# EAGLE schematic rgb_circuit_diagram_1R (EAGLE 7.5.0)
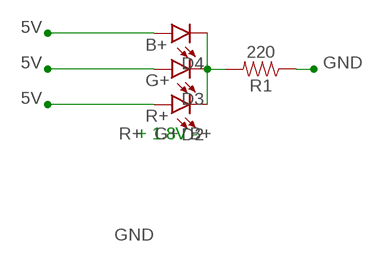
[diagram p0: schematic, sheet 1]

## Parts
D2  LED-3MM-NO_SILK  [LED_3MM-NS]
D3  LED-3MM-NO_SILK  [LED_3MM-NS]
D4  LED-3MM-NO_SILK  [LED_3MM-NS]
R1  220  220OHM-0603-1/10W-1%  [0603]

## Nets
B+: D4.A
G+: D3.A
GND: D2.K(C) D3.K(C) D4.K(C) R1.2
N$1: R1.1
R+: D2.A

## Notes on the sheet
- + 1.8V -

## Library data of the parts
D2-D4 = SparkFun-LED:LED: LED (Generic) Standard schematic elements and footprints for 5mm, 3mm, 1206, and 0603 sized LEDs. Generic LEDs with no color specified.
R1 = SparkFun-Resistors:220OHM: 220Ω resistor A resistor is a passive two-terminal electrical component that implements electrical resistance as a circuit element. Resistors act to reduce current flow, and, at the same time, act to lower voltage levels within circuits. - Wikipedia; PROD_ID: RES-07861